# Altium schematic sheet LM704A0_3V3_PINOUT.SchDoc
size C; SheetNumber: 9; SheetTotal: 25
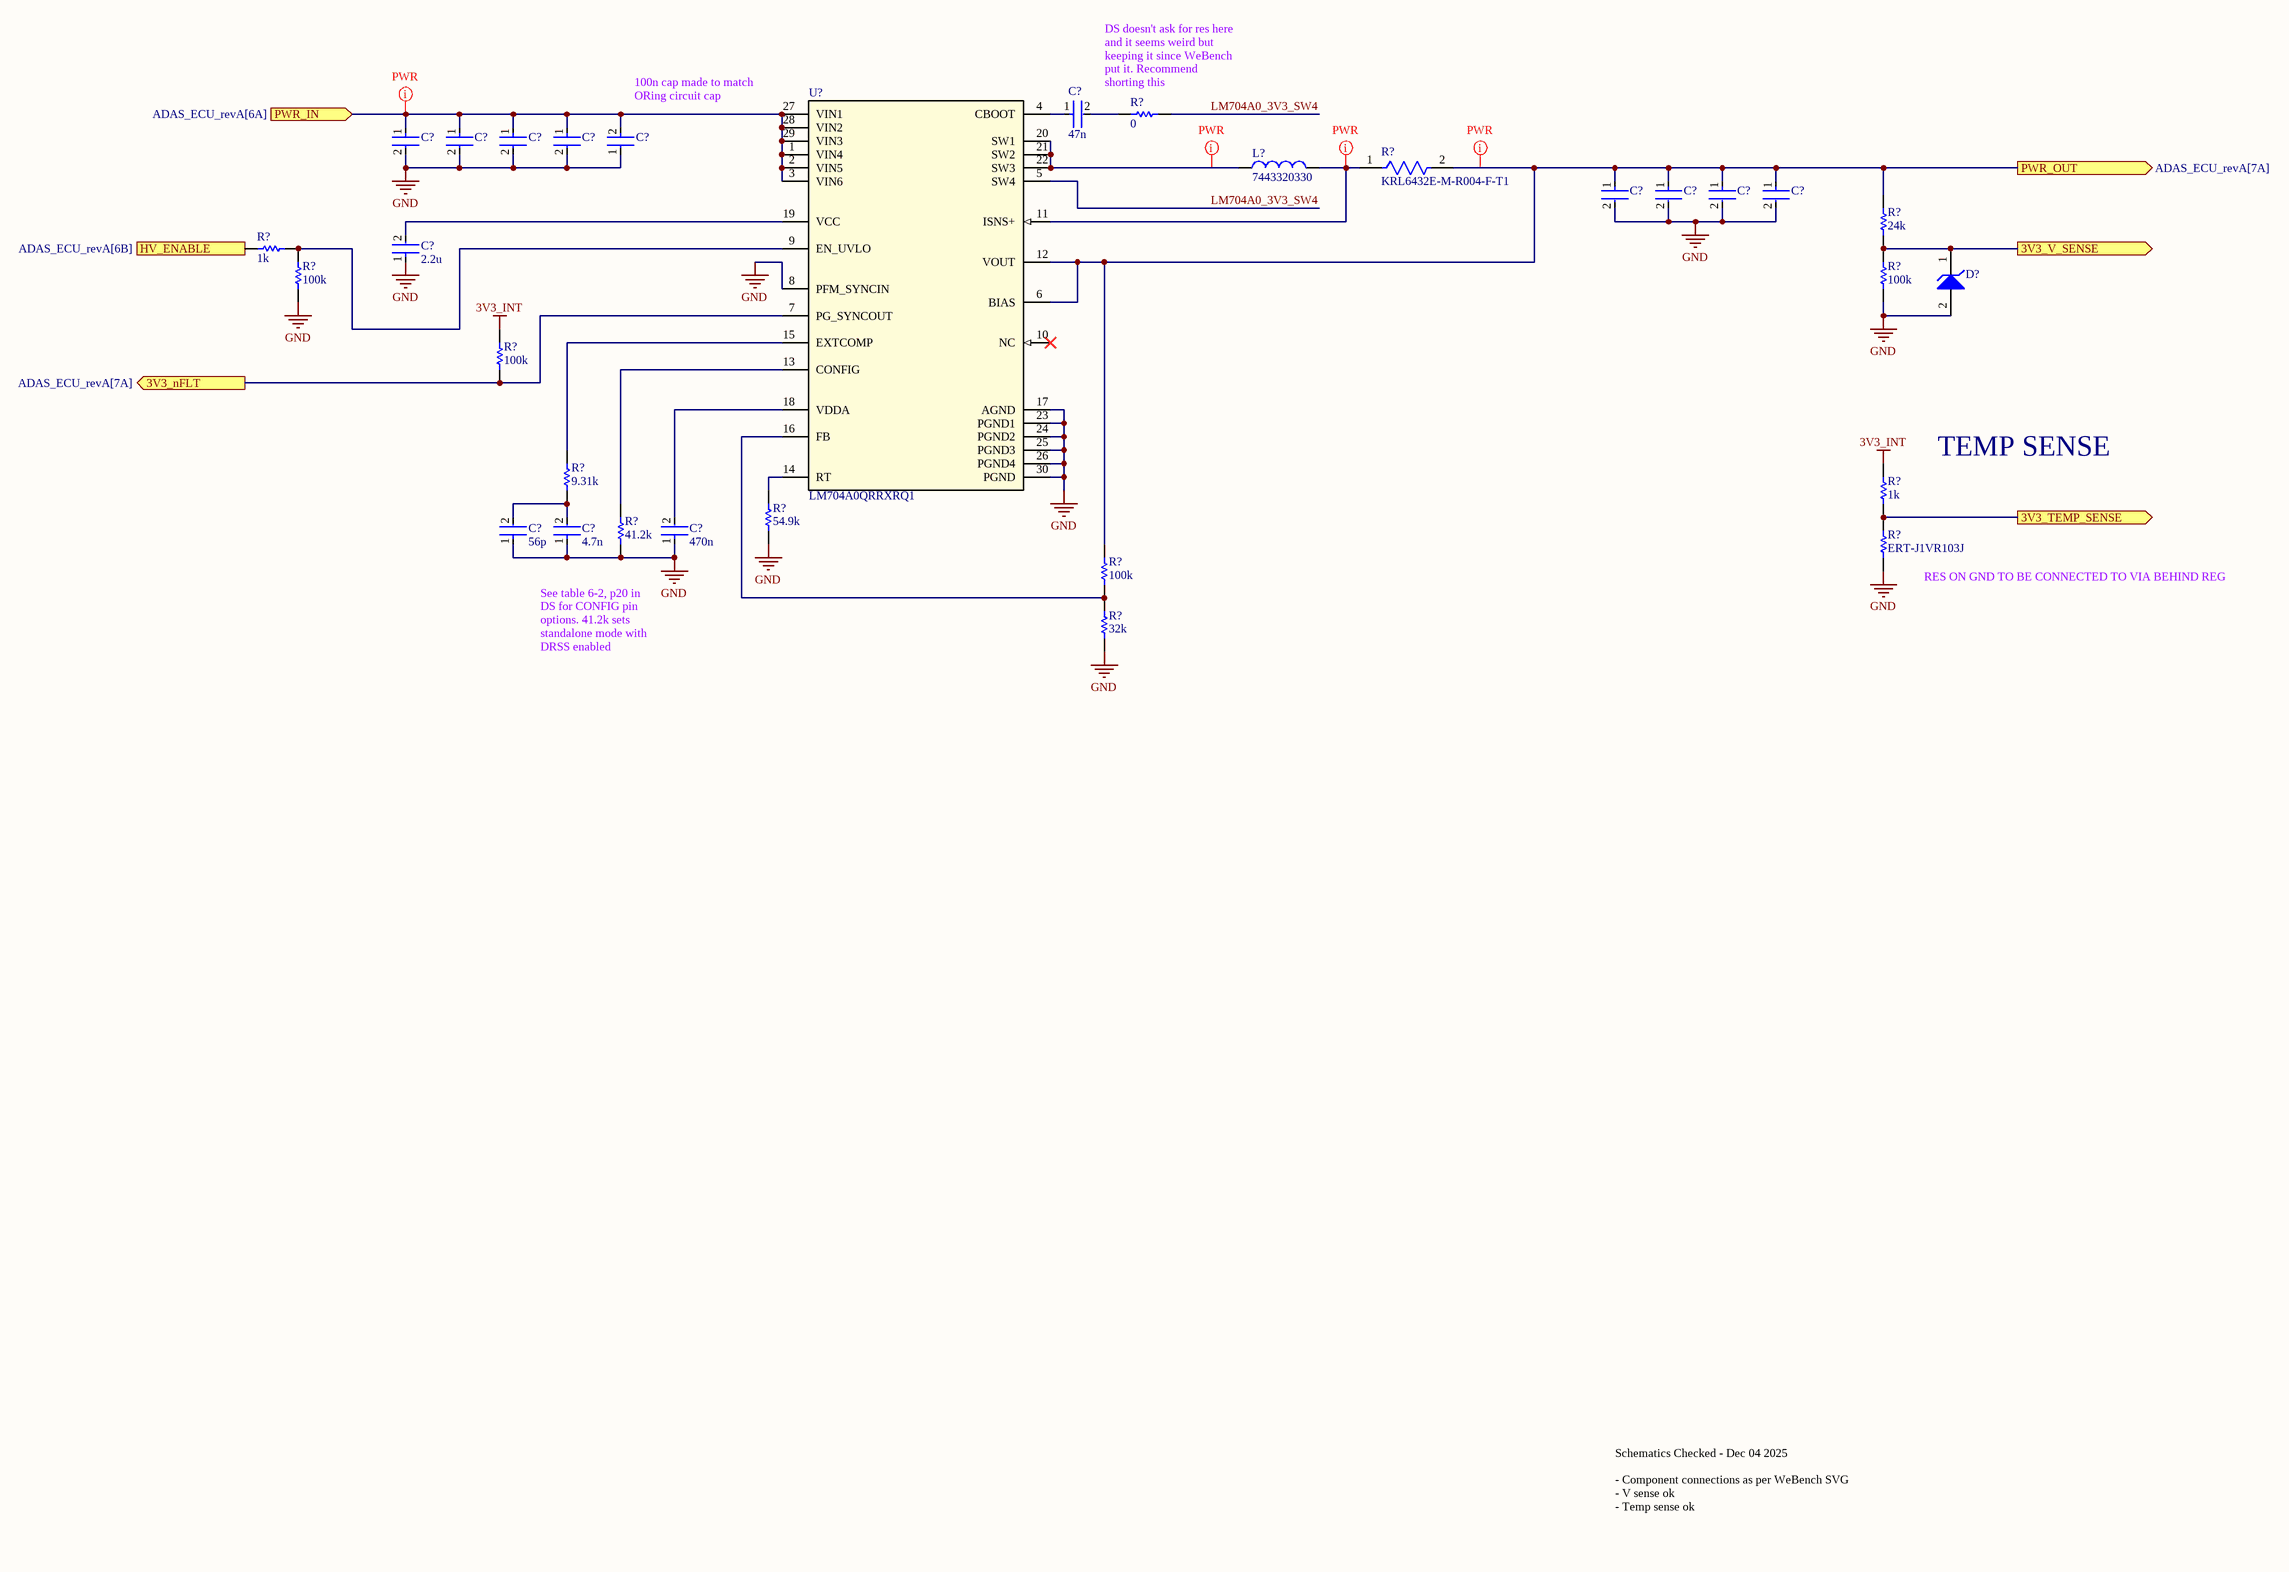
[diagram p0: LM704A0_3V3_PINOUT.SchDoc]

## Parts
(Parts that share a designator on the sheet are numbered #1, #2 ... from top to bottom, then left to right.)
C?#1  47n  [FP-0402-L_1_0_0_05-W_0_5-IPC_A]
C?#2  C3225X7R1H106M250AC  [FP-C3225-250-0_4-MFG]  (value not drawn)
C?#3  C3225X7R1H106M250AC  [FP-C3225-250-0_4-MFG]  (value not drawn)
C?#4  C3225X7R1H106M250AC  [FP-C3225-250-0_4-MFG]  (value not drawn)
C?#5  C3225X7R1H106M250AC  [FP-C3225-250-0_4-MFG]  (value not drawn)
C?#6  AC1210KKX7R0BB104  [FP-AC1210-0_85-MFG]  (value not drawn)
C?#7  GRM32EC80J107ME20L  [FP-GRM32E-0_3-0_2-IPC_C]  (value not drawn)
C?#8  GRM32EC80J107ME20L  [FP-GRM32E-0_3-0_2-IPC_C]  (value not drawn)
C?#9  GRM32EC80J107ME20L  [FP-GRM32E-0_3-0_2-IPC_C]  (value not drawn)
C?#10  GRM32EC80J107ME20L  [FP-GRM32E-0_3-0_2-IPC_C]  (value not drawn)
C?#11  2.2u  [FP-0402-L_1_0_0_05-W_0_5-IPC_A]
C?#12  56p  [FP-0402-L_1_0_0_05-W_0_5-IPC_A]
C?#13  4.7n  [FP-0402-L_1_0_0_05-W_0_5-IPC_A]
C?#14  470n  [FP-0402-L_1_0_0_05-W_0_5-IPC_A]
D?  DNP/MM5Z3V3T1G  [ONSC-SOD-523-2-502-01_V]  (value not drawn)
L?  7443320330  [WE-HCC_1210]
R?#1  0  [R0603B]
R?#2  KRL6432E-M-R004-F-T1  [FP-KRL6432E-MFG]
R?#3  24k  [R0603B]
R?#4  1k  [R0603B]
R?#5  100k  [R0603B]
R?#6  100k  [R0603B]
R?#7  100k  [R0603B]
R?#8  9.31k  [R0603B]
R?#9  1k  [R0603B]
R?#10  54.9k  [R0603B]
R?#11  41.2k  [R0603B]
R?#12  ERT-J1VR103J  [RESC1608X90X30ML15T20]
R?#13  100k  [R0603B]
R?#14  32k  [R0603B]
U?  LM704A0QRRXRQ1  [LM704A0QRRXRQ1-Footprint-1]

## Ports
3V3_nFLT (out, see ADAS_ECU_revA[7A]), 3V3_TEMP_SENSE (out), 3V3_V_SENSE (out), HV_ENABLE (in, see ADAS_ECU_revA[6B]), PWR_IN (in, see ADAS_ECU_revA[6A]), PWR_OUT (out, see ADAS_ECU_revA[7A])

## Nets
3V3_INT: R?#7.2 R?#9.1
GND: C?#2.2 C?#3.2 C?#4.2 C?#5.2 C?#6.1 C?#7.2 C?#8.2 C?#9.2 C?#10.2 C?#11.1 C?#12.1 C?#13.1 C?#14.1 D?.2(A) R?#5.1 R?#6.2 R?#10.2 R?#11.2 R?#12.1 R?#14.2 U?.8(PFM_SYNCIN) U?.17(AGND) U?.23(PGND1) U?.24(PGND2) U?.25(PGND3) U?.26(PGND4) U?.30(PGND)
3V3_nFLT: R?#7.1 U?.7(PG_SYNCOUT) ; port 3V3_nFLT
3V3_TEMP_SENSE: R?#9.2 R?#12.2 ; port 3V3_TEMP_SENSE
3V3_V_SENSE: D?.1(K) R?#3.2 R?#6.1 ; port 3V3_V_SENSE
HV_ENABLE: R?#4.2 ; port HV_ENABLE
LM704A0_3V3_SW4: R?#1.2 U?.5(SW4)
PWR_IN: C?#2.1 C?#3.1 C?#4.1 C?#5.1 C?#6.2 U?.1(VIN4) U?.2(VIN5) U?.3(VIN6) U?.27(VIN1) U?.28(VIN2) U?.29(VIN3) ; port PWR_IN
PWR_OUT: C?#7.1 C?#8.1 C?#9.1 C?#10.1 R?#2.2 R?#3.1 R?#13.1 U?.6(BIAS) U?.12(VOUT) ; port PWR_OUT
NetC?#1_1: C?#1.1 U?.4(CBOOT)
NetC?#1_2: C?#1.2 R?#1.1
NetC?#11_2: C?#11.2 U?.19(VCC)
NetC?#12_2: C?#12.2 C?#13.2 R?#8.2
NetC?#14_2: C?#14.2 U?.18(VDDA)
NetL?_1: L?.1 U?.20(SW1) U?.21(SW2) U?.22(SW3)
NetL?_2: L?.2 R?#2.1 U?.11(ISNS+)
NetR?#4_1: R?#4.1 R?#5.2 U?.9(EN_UVLO)
NetR?#8_1: R?#8.1 U?.15(EXTCOMP)
NetR?#10_1: R?#10.1 U?.14(RT)
NetR?#11_1: R?#11.1 U?.13(CONFIG)
NetR?#13_2: R?#13.2 R?#14.1 U?.16(FB)

Not connected (* = marked no-connect by the designer): U? 10(NC)*

## Layout directives
net class PWR: NetL?_1, NetL?_2, PWR_IN, PWR_OUT

## Notes on the sheet
- 100n cap made to match ORing circuit cap
- DS doesn't ask for res here and it seems weird but keeping it since WeBench put it. Recommend shorting this
- TEMP SENSE
- (near R?#12) RES ON GND TO BE CONNECTED TO VIA BEHIND REG
- See table 6-2, p20 in DS for CONFIG pin options. 41.2k sets standalone mode with DRSS enabled
- Schematics Checked - Dec 04 2025
  - Component connections as per WeBench SVG
  - V sense ok
  - Temp sense ok

## Library data of the parts
C?#1 C?#11-C?#14 = CMP-001-00058-1: LARGE PADS, 0402 CAP, CHANGE COMMENT TO MATCH REAL P/N; Capacitor Type: Ceramic; Min Operating Temperature: -55°C; Mounting Technology: Surface Mount; Pins: 2; Case/Package: 0402; RoHS Compliant: Yes; Max Operating Temperature: 85°C
C?#2-C?#5 = CMP-08246-002653-1: Multilayer Ceramic Capacitors 10uF ±20% 50V X7R SMD 1210; Width: 0.098inch; Package Quantity: 1000; Height: 2.5mm; Dielectric Material: Ceramic; Voltage Rating: 50V; Series: C; Capacitance: 10uF; Tolerance: 20%; Weight: 0.000564oz; Case/Package: 1210; Case Code (Imperial): 1210; Dielectric: X7R; Case Code (Metric): 3225; REACH SVHC: No SVHC; Packaging: Tape and Reel; Length: 0.126inch; Termination: SMD/SMT; Min Operating Temperature: -55°C; Voltage Rating (DC): 50V; Lead Free: Lead Free; Max Operating Temperature: 125°C; Thickness: 0.11inch; Mount: Surface Mount
C?#6 = CMP-03422-000642-1: CAP CER 0.1UF 100V X7R 1210; Manufacturer: Yageo; Automotive Grade: Grade 1; Capacitance: 100 nF; Material: Ceramic; Value: 100 nF; Temperature Coefficient: 15%; Tolerance: 0.1; Automotive: Yes; ComponentLink2Description: Datasheet; Device Class L2: Capacitors; Height: 0.95mm; Manufacturer Part Number: AC1210KKX7R0BB104; Temperature: -55°C to +125°C; Voltage Rating: 100 V; Device Class L1: Passive Components; ComponentLink2URL: http://www.yageo.com/documents/recent/UPY-AC_NP0X7R_16V-to-630V_12.pdf; Lead Free: Yes; Category: Cap; Temperature Range High: +125°C; RoHS: TRUE; Digikey Description: CAP CER 0.1UF 100V X7R 1210; Temperature Range Low: -55°C; Octopart: https://octopart.com/ac1210kkx7r0bb104-yageo-78873719; Device Class L3: Ceramic Capacitors; Ipc Land Pattern Name: CAPC320250X85; Package: AC1210-0.85; Footprint Url: http://www.yageo.com/exep/pages/download/literatures/UPY-C_GEN_24.pdf; Temperature Characteristic: X7R
C?#7-C?#10 = CMP-2000-06362-2: DIFF P/N 100UF 6.3V GRM32EC80J107ME20L; Voltage: 16V; Tolerance: 10%; Capacitance: 47uF; Dielectric: X5R; Material: Ceramic; Case Code (Metric): 3225; RoHS Compliant: Yes; Min Operating Temperature: -55°C; Radiation Hardening: No; Package Quantity: 1; Case Code (Imperial): 1210; REACH SVHC: No SVHC; Voltage Rating (DC): 16V; Case/Package: 1210; Length: 3.2mm; Voltage Rating: 16V; Packaging: Cut Tape; Width: 0.098inch; Number of Pins: 2; Lead Free: Lead Free; Height: 2.5mm; Mount: Surface Mount; Termination: SMD/SMT; Max Operating Temperature: 85°C; Thickness: 0.106inch; Depth: 2.5mm
D? = CMP-1060-00750-1: Zener Voltage Regulator, 500 mW, 2-Pin SOD-523, Pb-Free, Tape and Reel; Manufacturer: On Semiconductor; P Max (W): 0.5; VZ Typ (V): 3.3; RoHS: Pb-Free; ComponentLink2Description: Datasheet; PackageReference: SOD-523-2-502-01; DatasheetVersion: Rev. 10; ComponentLink1Description: Manufacturer URL; PackageVersion: Rev. E, 09/2010; ComponentLink3URL: http://www.onsemi.com/pub_link/Collateral/502-01.PDF; ComponentLink2URL: http://www.onsemi.cn/pub_link/Collateral/MM5Z2V4T1-D.PDF; Mounting Technology: Surface Mount; PartNumber: MM5Z3V3T1G; Packing: Tape and Reel; PackageDescription: 2-Pin SOD, Body 1.2 x 0.8 mm; ComponentLink1URL: http://www.onsemi.com/; ComponentLink3Description: Package Specification
L? = CMP-0226-00120-2: NexarPartId: 22803324; Self Resonant Frequency: 44MHz; DC Resistance (DCR): 5.2mΩ; Saturation Current: 22.4A; Inductance Tolerance: 20%; Material: Ferrite; Inductance: 3.3µH; Current Rating: 17A; Height: 9.5mm; Number of Pins: 2; Length: 12.1mm; Width: 11.4mm; Packaging: Tape & Reel (TR); Ambient Temperature Range High: 75°C; RoHS: Compliant; Max Operating Temperature: 125°C; Min Operating Temperature: -40°C; Ambient Temperature Range Low: -40°C; Core Material: Ferrite
R?#1 R?#4-R?#11 R?#13 R?#14 = CMP-009-00002-14: Resistor
  R?#6: Value: 100k
  R?#9: Value: 1k
R?#2 = CMP-00597-24927457-1: KRL6432E-M-R004-F-T1 Metal Foil Low Resistance Chip Resistor (long-side terminal), 2512, RoHS; Power Rating: 3W; Temperature Coefficient: 50ppm/°C; Tolerance: 1%; Resistance: 4mΩ; Length: 3.1mm; Composition: Metal Foil; Termination: SMD/SMT; Max Operating Temperature: 155°C; Case Code (Imperial): 2512; NexarPartId: 24927457; Width: 6.3mm; Max Power Dissipation: 3W; Case Code (Metric): 6432; Min Operating Temperature: -55°C; Packaging: Digi-Reel®; Max Thickness: 700µm; Lifecycle Status: Production; Height: 700µm; Weight: 40.511469mg; Case/Package: 2512; RoHS: Compliant; Number of Terminations: 2
R?#3 = CMP-009-00002-14: Resistor; Value: 100k
R?#12 = CMP-2000-00869-1: Manufacturer: Panasonic; Part Number: ERT-J1VR103J
U? = CMP-019-00058-1: Automotive, High-density, 4.5V to 45V input, 10A low-EMI synchronous DC/DC step-down converter 29-VQFN -40 to 150; Case/Package: VQFN; Pins: 29